# Altium schematic sheet Sheet1.SchDoc
size A2
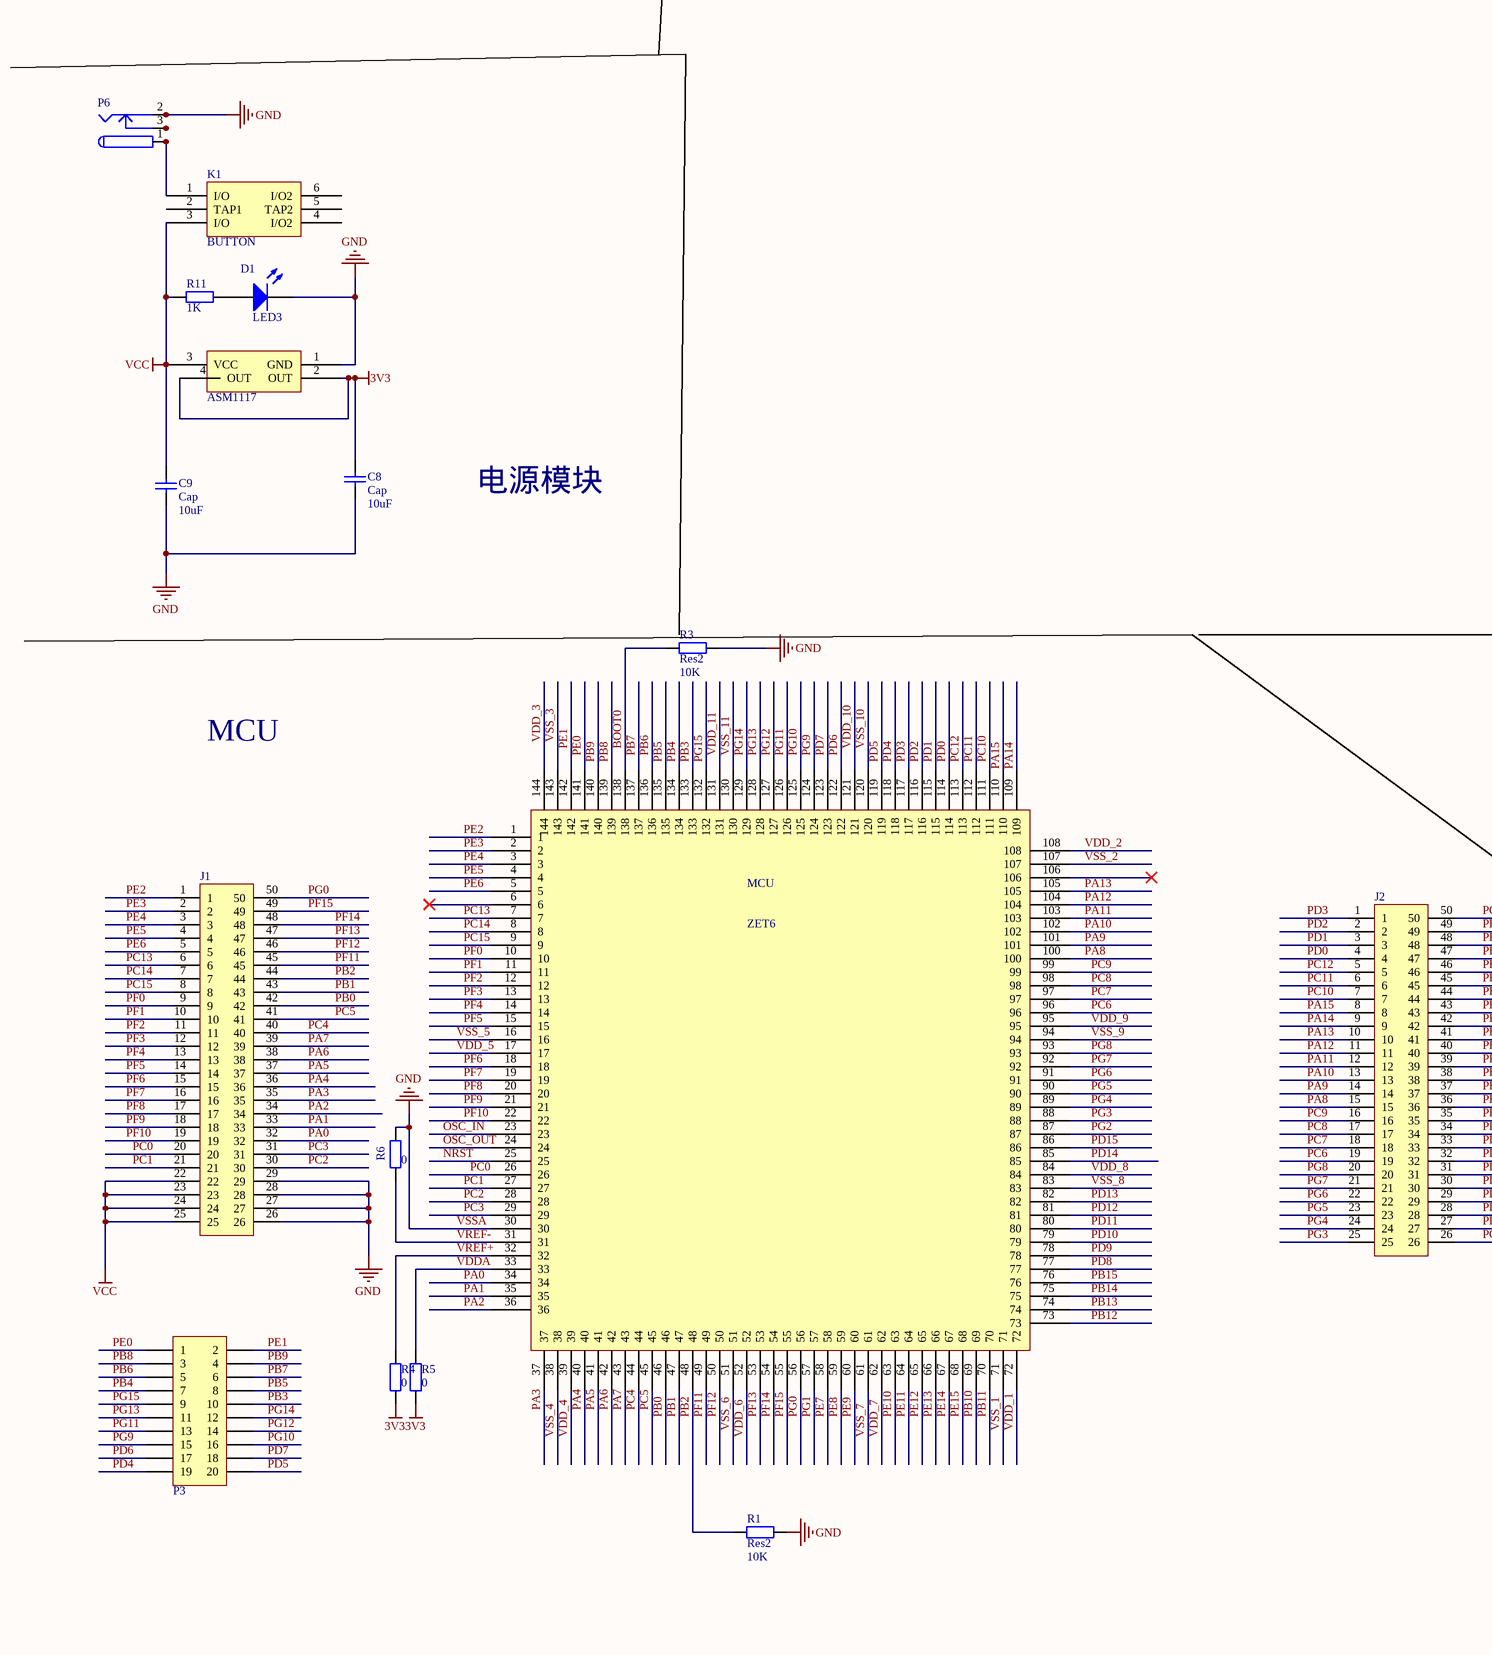
[diagram p0: Sheet1.SchDoc, left]
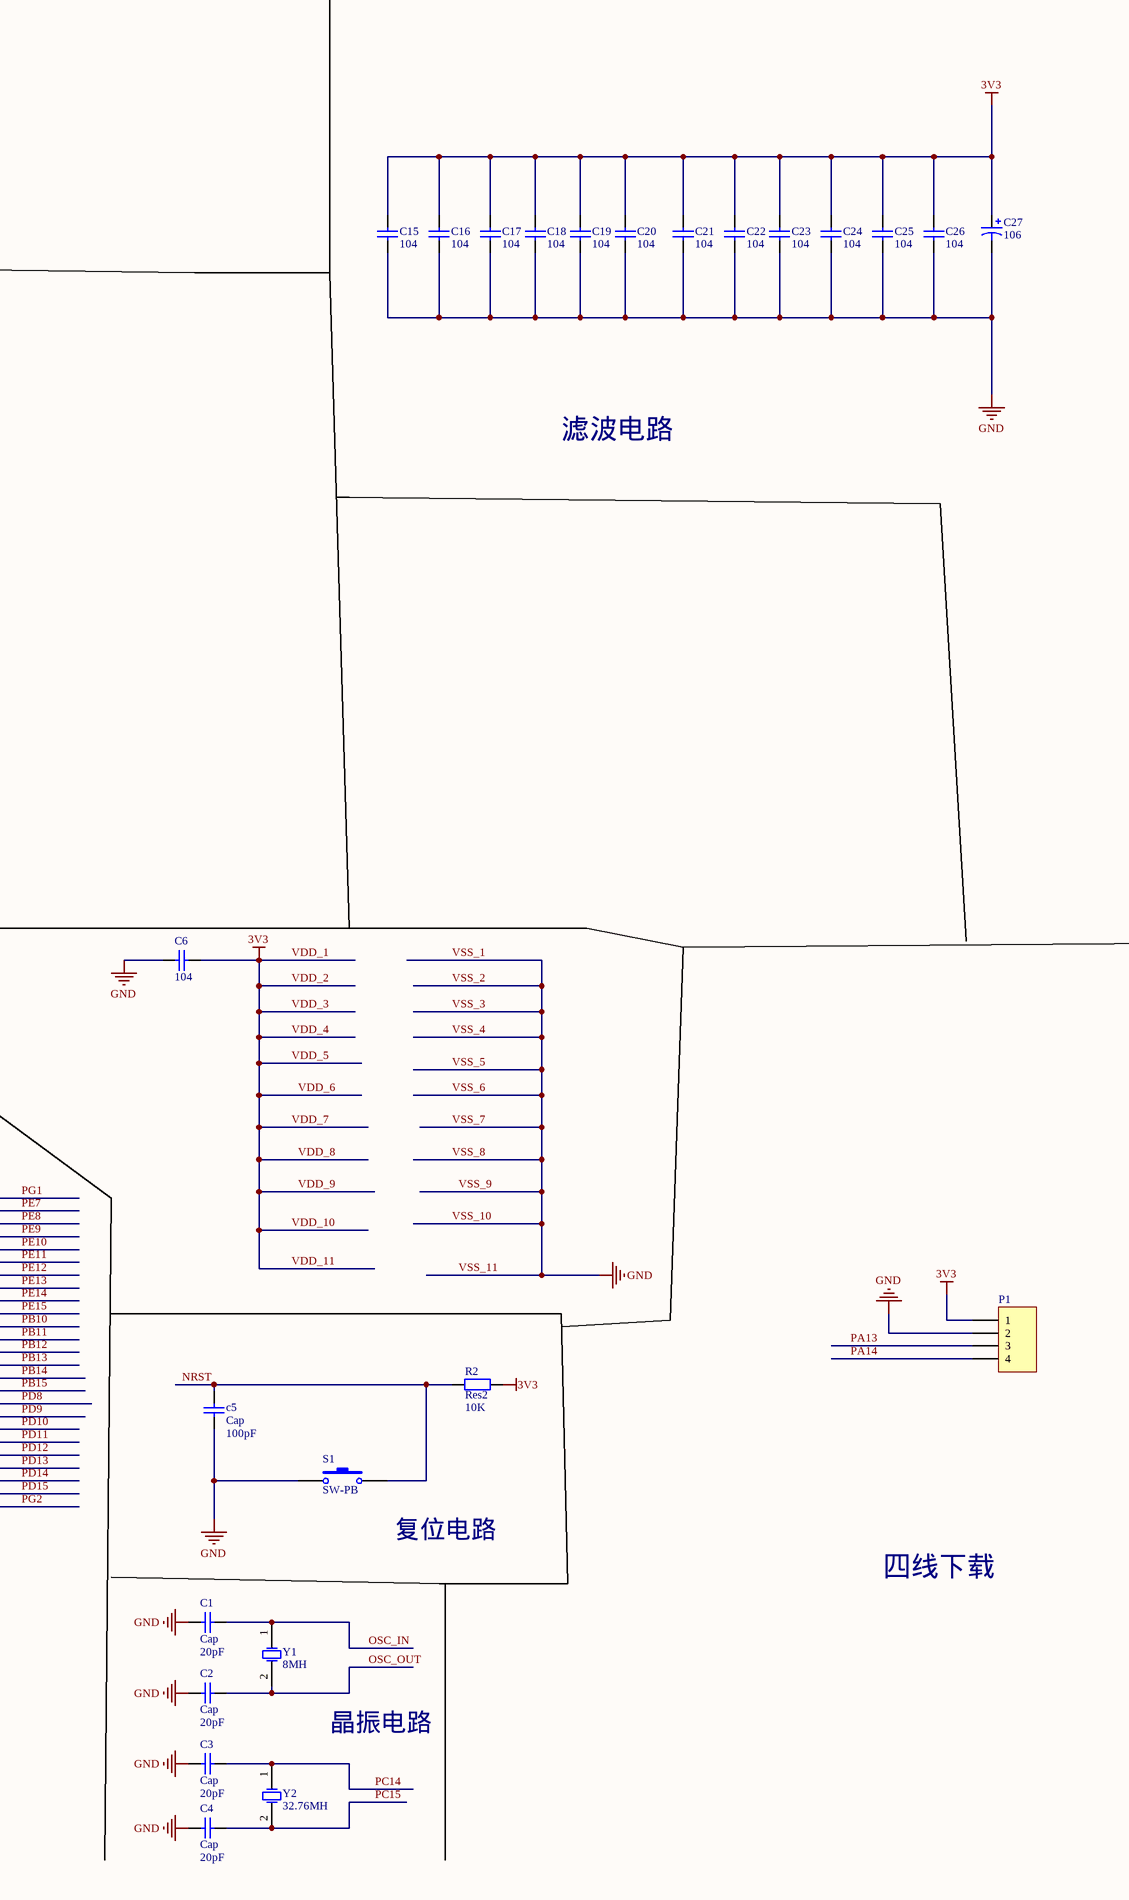
[diagram p1: Sheet1.SchDoc, right]

## Parts
*  ASM1117  [AMS1117]
C1  Cap  value 20pF  [0805]
C2  Cap  value 20pF  [0805]
C3  Cap  value 20pF  [0805]
C4  Cap  value 20pF  [0805]
c5  Cap  value 100pF  [0805]
C6  value 104  [0805]  (hidden comment: Cap Semi)
C8  Cap  value 10uF  [0805]
C9  Cap  value 10uF  [0805]
C15  value 104  [0805]  (hidden comment: Cap)
C16  value 104  [0805]  (hidden comment: Cap)
C17  value 104  [0805]  (hidden comment: Cap)
C18  value 104  [0805]  (hidden comment: Cap)
C19  value 104  [0805]  (hidden comment: Cap)
C20  value 104  [0805]  (hidden comment: Cap)
C21  value 104  [0805]  (hidden comment: Cap)
C22  value 104  [0805]  (hidden comment: Cap)
C23  value 104  [0805]  (hidden comment: Cap)
C24  value 104  [0805]  (hidden comment: Cap)
C25  value 104  [0805]  (hidden comment: Cap)
C26  value 104  [0805]  (hidden comment: Cap)
C27  value 106  [CC6.56.5]  (hidden comment: Cap Pol1)
D1  LED3  [RB.1]
J1  Edge Con 50  [HDR2X25]  (value not drawn)
J2  Edge Con 50  [HDR2X25]  (value not drawn)
K1  BUTTON  [BTN8.5*8.5]
P1  Header 4  [HDR1X4]  (value not drawn)
P3  Header 10X2H  [HDR2X10]  (value not drawn)
P6  PWR2.5  [POWER_002]  (value not drawn)
R1  Res2  value 10K  [0805]
R2  Res2  value 10K  [0805]
R3  Res2  value 10K  [0805]
R4  value 0  [0805]  (hidden comment: Res2)
R5  value 0  [0805]  (hidden comment: Res2)
R6  value 0  [0805]  (hidden comment: Res2)
R11  value 1K  [0805]  (hidden comment: Res2)
S1  SW-PB  [key4]
Y1  8MH  [XTAL_US]
Y2  32.76MH  [XTAL4]
ZET6  MCU  [LQFP144]

## Nets
VCC: *.3(VCC) C9.2 J1.22 J1.23 J1.24 J1.25 K1.3(I/O) R11.1
VDD_1: *.2(OUT) *.4(OUT) C6.2 C8.2 C15.2 C16.2 C17.1 C18.2 C19.2 C20.2 C21.2 C22.2 C23.2 C24.2 C25.2 C26.2 C27.1 P1.1 R2.2 R4.1 R5.1 ZET6.17 ZET6.39 ZET6.52 ZET6.62 ZET6.72 ZET6.84 ZET6.95 ZET6.108 ZET6.121 ZET6.131 ZET6.144  [also labelled 3V3, VDD_10, VDD_11, VDD_2, VDD_3, VDD_4, VDD_5, VDD_6, VDD_7, VDD_8, VDD_9]
VSS_1: *.1(GND) C1.1 C2.1 C3.1 C4.1 c5.1 C6.1 C8.1 C9.1 C15.1 C16.1 C17.2 C18.1 C19.1 C20.1 C21.1 C22.1 C23.1 C24.1 C25.1 C26.1 C27.2 D1.2(K) J1.26 J1.27 J1.28 J1.29 P1.2 P6.2 P6.2A P6.2B R1.2 R3.2 R6.2 S1.1 ZET6.16 ZET6.30 ZET6.38 ZET6.51 ZET6.61 ZET6.71 ZET6.83 ZET6.94 ZET6.107 ZET6.120 ZET6.130 ZET6.143  [also labelled GND, VSS_10, VSS_11, VSS_2, VSS_3, VSS_4, VSS_5, VSS_6, VSS_7, VSS_8, VSS_9, VSSA]
BOOT0: R3.1 ZET6.138
NRST: c5.2 R2.1 S1.2 ZET6.25
OSC_IN: C1.2 Y1.1(OSC1) ZET6.23
OSC_OUT: C2.2 Y1.2(OSC2) ZET6.24
PA0: J1.32 ZET6.34
PA1: J1.33 ZET6.35
PA2: J1.34 ZET6.36
PA3: J1.35 ZET6.37
PA4: J1.36 ZET6.40
PA5: J1.37 ZET6.41
PA6: J1.38 ZET6.42
PA7: J1.39 ZET6.43
PA8: J2.15 ZET6.100
PA9: J2.14 ZET6.101
PA10: J2.13 ZET6.102
PA11: J2.12 ZET6.103
PA12: J2.11 ZET6.104
PA13: J2.10 P1.3 ZET6.105
PA14: J2.9 P1.4 ZET6.109
PA15: J2.8 ZET6.110
PB0: J1.42 ZET6.46
PB1: J1.43 ZET6.47
PB2: J1.44 R1.1 ZET6.48
PB3: P3.10 ZET6.133
PB4: P3.7 ZET6.134
PB5: P3.8 ZET6.135
PB6: P3.5 ZET6.136
PB7: P3.6 ZET6.137
PB8: P3.3 ZET6.139
PB9: P3.4 ZET6.140
PB10: J2.40 ZET6.69
PB11: J2.39 ZET6.70
PB12: J2.38 ZET6.73
PB13: J2.37 ZET6.74
PB14: J2.36 ZET6.75
PB15: J2.35 ZET6.76
PC0: J1.20 ZET6.26
PC1: J1.21 ZET6.27
PC2: J1.30 ZET6.28
PC3: J1.31 ZET6.29
PC4: J1.40 ZET6.44
PC5: J1.41 ZET6.45
PC6: J2.19 ZET6.96
PC7: J2.18 ZET6.97
PC8: J2.17 ZET6.98
PC9: J2.16 ZET6.99
PC10: J2.7 ZET6.111
PC11: J2.6 ZET6.112
PC12: J2.5 ZET6.113
PC13: J1.6 ZET6.7
PC14: C3.2 J1.7 Y2.1(OSC1) ZET6.8
PC15: C4.2 J1.8 Y2.2(OSC2) ZET6.9
PD0: J2.4 ZET6.114
PD1: J2.3 ZET6.115
PD2: J2.2 ZET6.116
PD3: J2.1 ZET6.117
PD4: P3.19 ZET6.118
PD5: P3.20 ZET6.119
PD6: P3.17 ZET6.122
PD7: P3.18 ZET6.123
PD8: J2.34 ZET6.77
PD9: J2.33 ZET6.78
PD10: J2.32 ZET6.79
PD11: J2.31 ZET6.80
PD12: J2.30 ZET6.81
PD13: J2.29 ZET6.82
PD14: J2.28 ZET6.85
PD15: J2.27 ZET6.86
PE0: P3.1 ZET6.141
PE1: P3.2 ZET6.142
PE2: J1.1 ZET6.1
PE3: J1.2 ZET6.2
PE4: J1.3 ZET6.3
PE5: J1.4 ZET6.4
PE6: J1.5 ZET6.5
PE7: J2.49 ZET6.58
PE8: J2.48 ZET6.59
PE9: J2.47 ZET6.60
PE10: J2.46 ZET6.63
PE11: J2.45 ZET6.64
PE12: J2.44 ZET6.65
PE13: J2.43 ZET6.66
PE14: J2.42 ZET6.67
PE15: J2.41 ZET6.68
PF0: J1.9 ZET6.10
PF1: J1.10 ZET6.11
PF2: J1.11 ZET6.12
PF3: J1.12 ZET6.13
PF4: J1.13 ZET6.14
PF5: J1.14 ZET6.15
PF6: J1.15 ZET6.18
PF7: J1.16 ZET6.19
PF8: J1.17 ZET6.20
PF9: J1.18 ZET6.21
PF10: J1.19 ZET6.22
PF11: J1.45 ZET6.49
PF12: J1.46 ZET6.50
PF13: J1.47 ZET6.53
PF14: J1.48 ZET6.54
PF15: J1.49 ZET6.55
PG0: J1.50 ZET6.56
PG1: J2.50 ZET6.57
PG2: J2.26 ZET6.87
PG3: J2.25 ZET6.88
PG4: J2.24 ZET6.89
PG5: J2.23 ZET6.90
PG6: J2.22 ZET6.91
PG7: J2.21 ZET6.92
PG8: J2.20 ZET6.93
PG9: P3.15 ZET6.124
PG10: P3.16 ZET6.125
PG11: P3.13 ZET6.126
PG12: P3.14 ZET6.127
PG13: P3.11 ZET6.128
PG14: P3.12 ZET6.129
PG15: P3.9 ZET6.132
VDDA: R5.2 ZET6.33
VREF+: R4.2 ZET6.32
VREF-: R6.1 ZET6.31
NetD1_1: D1.1(A) R11.2
NetK1_1: K1.1(I/O) P6.1 P6.1A P6.1B
NetP6_3: P6.3 P6.3A P6.3B

Not connected (* = marked no-connect by the designer): K1 2(TAP1) 4(I/O2) 5(TAP2) 6(I/O2); ZET6 6* 106*

## Notes on the sheet
- 滤波电路
- 电源模块
- MCU
- (near S1) 复位电路
- 四线下载
- 晶振电路

## Library data of the parts
C1-C4 c5 C8 C9 C15-C26 = Cap: Capacitor; Published: 8-Jun-2000; LatestRevisionDate: 17-Jul-2002; LatestRevisionNote: Re-released for DXP Platform.; PackageReference: RAD-0.3; Publisher: Altium Limited; PackageDescription: Radial Cap, Thru-Hole; 2 Leads; 0.3 in Pin Spacing
C6 = Cap Semi: Capacitor (Semiconductor SIM Model); Published: 8-Jun-2000; LatestRevisionDate: 29-May-2009; LatestRevisionNote: IPC-7351 Footprint Added.; PackageReference: C1206; Publisher: Altium Limited; PackageDescription: Chip Capacitor
C27 = Cap Pol1: Polarized Capacitor (Radial); Published: 8-Jun-2000; LatestRevisionDate: 17-Jul-2002; LatestRevisionNote: Re-released for DXP Platform.; PackageReference: RB7.6-15; Publisher: Altium Limited; PackageDescription: Polarized Capacitor (Radial); 2 Leads
D1 = LED3: Typical BLUE SiC LED; Published: 8-Jun-2000; LatestRevisionDate: 17-Dec-2003; LatestRevisionNote: PCB Footprint replaced.; DatasheetVersion: 16-Apr-2002; PackageVersion: 16-Apr-2002; PackageReference: 3.5X2.8X1.9; Publisher: Altium Limited; PackageDescription: SM LED; 2 C-Bend Leads; Body 3.5 x 2.8 x 1.9 mm, inc leads (LxWxH typ)
J1 J2 = Edge Con 50: 50-Pin Edge Connector; LatestRevisionDate: 17-Jul-2002; LatestRevisionNote: Re-released for DXP Platform.; Publisher: Altium Limited
P1 = Header 4: Header, 4-Pin; LatestRevisionDate: 17-Jul-2002; LatestRevisionNote: Re-released for DXP Platform.; Publisher: Altium Limited
P3 = Header 10X2H: Header, 10-Pin, Dual row, Right Angle; LatestRevisionDate: 17-Jul-2002; LatestRevisionNote: Re-released for DXP Platform.; Publisher: Altium Limited
P6 = PWR2.5: Low Voltage Power Supply Connector; Published: 17-Dec-2003; DatasheetDocument: 09-May-2002; Publisher: Altium Limited; ComponentLink1Description: Manufacturer Link; ComponentLink1URL: http://domino.kycon.com/internet/Products.html
R1-R6 R11 = Res2: Resistor; Published: 8-Jun-2000; LatestRevisionDate: 17-Jul-2002; LatestRevisionNote: Re-released for DXP Platform.; PackageReference: AXIAL-0.4; Publisher: Altium Limited; PackageDescription: Axial Device, Thru-Hole; 2 Leads; 0.4 in Pin Spacing
S1 = SW-PB: Switch; Published: 24-Mar-1999; LatestRevisionDate: 17-Jul-2002; LatestRevisionNote: Re-released for DXP Platform.; PackageReference: SPST-2; Publisher: Altium Limited; PackageDescription: Switch; 2 Leads
Y1 Y2 = XTAL: Crystal Oscillator; Published: 8-Jun-2000; LatestRevisionDate: 17-Jul-2002; LatestRevisionNote: Re-released for DXP Platform.; PackageReference: R38; Publisher: Altium Limited; PackageDescription: Crystal, Thru-Hole; 2 Leads; Body 3.1 x 8.2 mm (Dia.xH)
ZET6 = Component_1